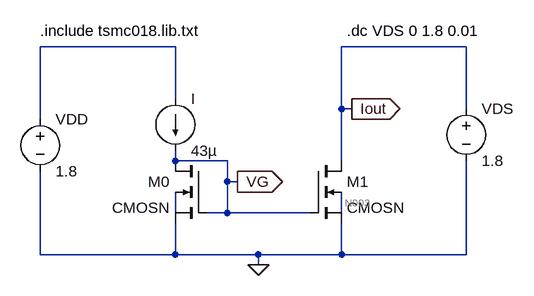
[diagram p0: schematic Current mirror.asc]
Current mirror.asc, the LTspice schematic file:
Version 4
SHEET 1 880 680
WIRE -112 -32 -320 -32
WIRE 336 -32 144 -32
WIRE -112 48 -112 -32
WIRE 144 64 144 -32
WIRE 160 64 144 64
WIRE 336 64 336 -32
WIRE -320 80 -320 -32
WIRE -112 144 -112 128
WIRE -32 144 -112 144
WIRE 144 144 144 64
WIRE -32 176 -32 144
WIRE -16 176 -32 176
WIRE -112 224 -112 192
WIRE -32 224 -32 176
WIRE -32 224 -64 224
WIRE 96 224 -32 224
WIRE 144 224 144 192
WIRE -320 288 -320 160
WIRE -112 288 -112 240
WIRE -112 288 -320 288
WIRE 16 288 -112 288
WIRE 144 288 144 240
WIRE 144 288 16 288
WIRE 336 288 336 144
WIRE 336 288 144 288
WIRE 16 304 16 288
FLAG 16 304 0
FLAG 160 64 Iout
IOPIN 160 64 Out
FLAG -16 176 VG
IOPIN -16 176 Out
SYMBOL nmos4 96 144 R0
SYMATTR InstName M1
SYMATTR Value CMOSN
SYMATTR Value2 l=50m w=50m
SYMBOL nmos4 -64 144 M0
SYMATTR InstName M0
SYMATTR Value CMOSN
SYMATTR Value2 l=50m w=50m
SYMBOL current -112 48 R0
WINDOW 123 0 0 Left 0
WINDOW 39 0 0 Left 0
SYMATTR InstName I
SYMATTR Value 43µ
SYMBOL voltage -320 64 R0
WINDOW 123 0 0 Left 0
WINDOW 39 0 0 Left 0
SYMATTR InstName VDD
SYMATTR Value 1.8
SYMBOL voltage 336 48 R0
SYMATTR InstName VDS
SYMATTR Value 1.8
TEXT -320 -56 Left 2 !.include tsmc018.lib.txt
TEXT 152 -56 Left 2 !.dc VDS 0 1.8 0.01

The netlist it stands for:
* Current mirror.asc
M1 Iout VG 0 N003 CMOSN l=50m w=50m
M0 VG VG 0 N002 CMOSN l=50m w=50m
I N001 VG 43µ
VDD N001 0 1.8
VDS Iout 0 1.8
.model NMOS NMOS
.model PMOS PMOS
.lib standard.mos
.include tsmc018.lib.txt
.dc VDS 0 1.8 0.01
.backanno
.end

* Results of the author's LTspice run, read from the files saved beside the schematic
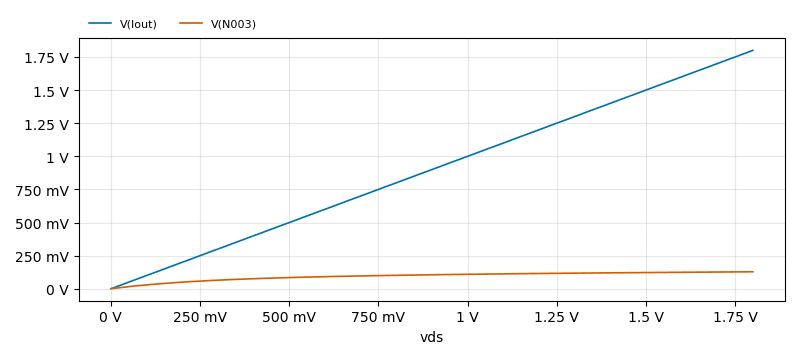
[diagram p1: DC transfer characteristic of Current mirror.asc, plotted from the saved traces]
* DC transfer characteristic, 1 run:
*   V(Iout): 0 V at vds=0 V, 1.8 V at vds=1.8 V, min 0 V, max 1.8 V
*   V(N003): -2.597e-17 fV at vds=0 V, 128.4 mV at vds=1.8 V, min -2.597e-17 fV, max 128.4 mV